# Altium project Delibird.PrjPcb
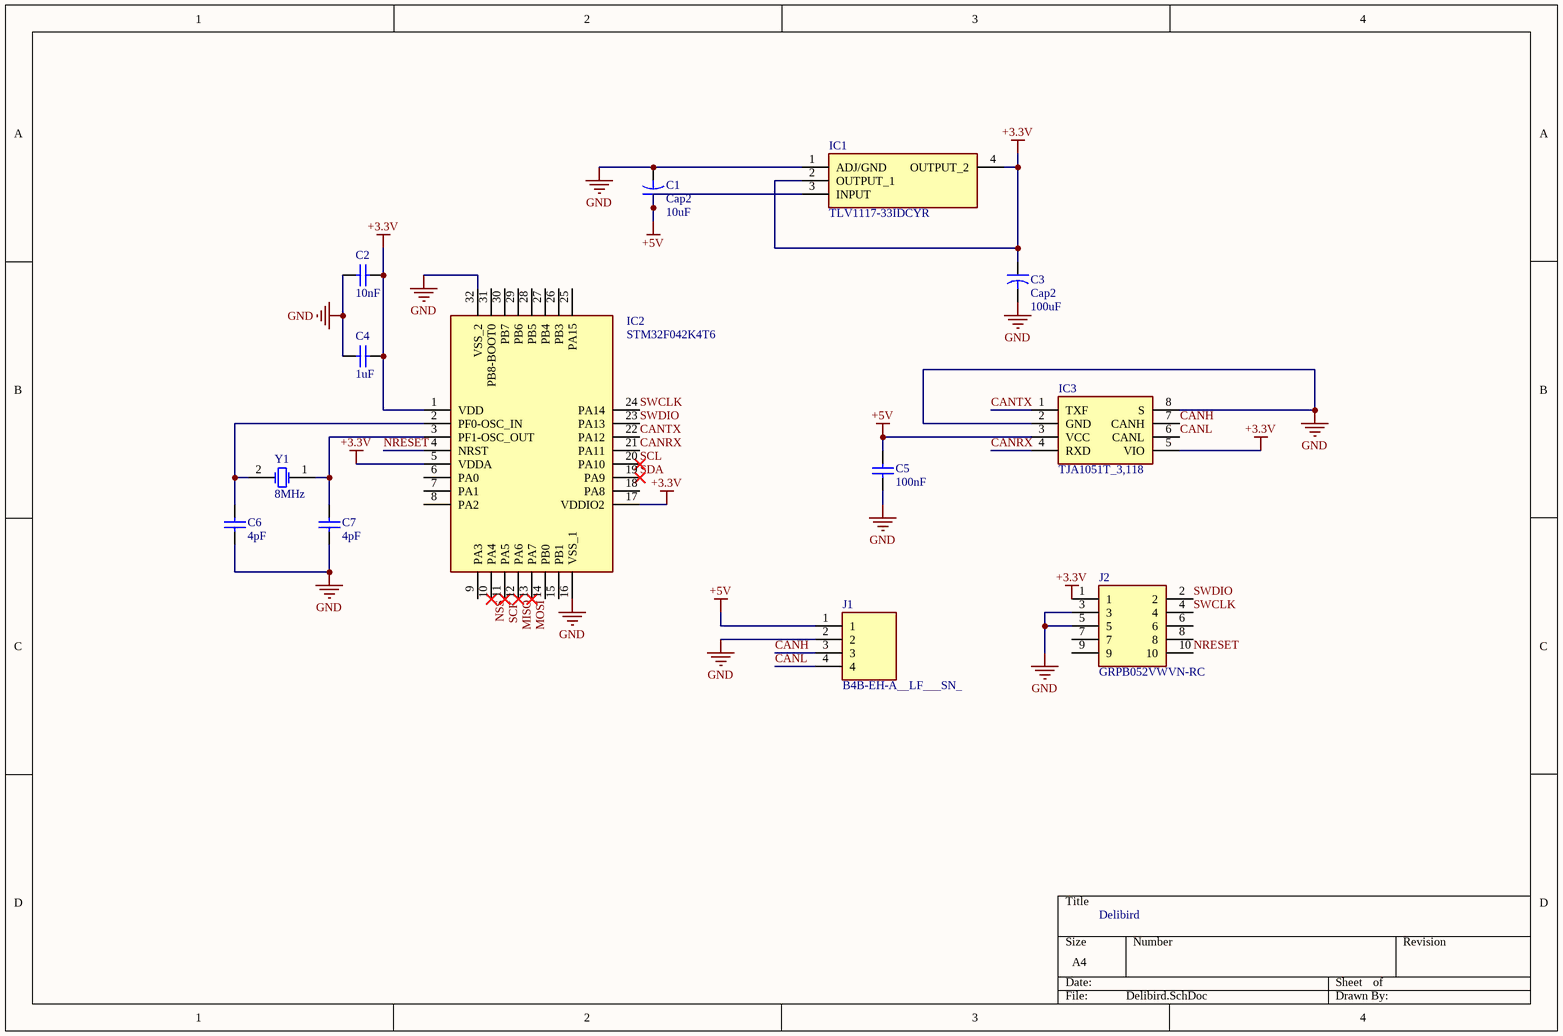
[diagram p0: Delibird.SchDoc]
1 sheet, 13 parts. Net scope: global (net labels, ports and power ports of the same name join across sheets).
Board file: Delibird.PcbDoc

## Sheet Delibird.SchDoc
size A4

### Parts
C1  Cap2  value 10uF  [C0805]
C2  value 10nF  [0805 - Capacitor]  (hidden comment: Capacitor - Nonpolarized)
C3  Cap2  value 100uF  [C0805]
C4  value 1uF  [0805 - Capacitor]  (hidden comment: Capacitor - Nonpolarized)
C5  value 100nF  [0805 - Capacitor]  (hidden comment: Capacitor - Nonpolarized)
C6  value 4pF  [0805 - Capacitor]  (hidden comment: Capacitor - Nonpolarized)
C7  value 4pF  [0805 - Capacitor]  (hidden comment: Capacitor - Nonpolarized)
IC1  TLV1117-33IDCYR  [SOT230P700X180-4N]
IC2  STM32F042K4T6  [QFP80P900X900X160-32N]
IC3  TJA1051T_3,118  [SOIC127P600X175-8N]
J1  B4B-EH-A__LF___SN_  [SHDR4W64P0X250_1X4_1250X380X600P]
J2  GRPB052VWVN-RC  [HDRV10W50P127_2X5_635X340X430P]
Y1  value 8MHz  [CX5032GB08000H0HPQZ1]  (hidden comment: Oscillator)

### Nets
+3.3V: C2.1 C3.1 C4.1 IC1.2(OUTPUT_1) IC1.4(OUTPUT_2) IC2.1(VDD) IC2.5(VDDA) IC2.17(VDDIO2) IC3.5(VIO) J2.1
+5V: C1.1 C5.1 IC1.3(INPUT) IC3.3(VCC) J1.1
GND: C1.2 C2.2 C3.2 C4.2 C5.2 C6.1 C7.1 IC1.1(ADJ/GND) IC2.16(VSS_1) IC2.32(VSS_2) IC3.2(GND) IC3.8(S) J1.2 J2.3 J2.5
CANH: IC3.7(CANH) J1.3
CANL: IC3.6(CANL) J1.4
CANRX: IC2.21(PA11) IC3.4(RXD)
CANTX: IC2.22(PA12) IC3.1(TXF)
MISO: IC2.12(PA6)
MOSI: IC2.13(PA7)
NRESET: IC2.4(NRST) J2.10
NSS: IC2.10(PA4)
SCK: IC2.11(PA5)
SCL: IC2.20(PA10)
SDA: IC2.19(PA9)
SWCLK: IC2.24(PA14) J2.4
SWDIO: IC2.23(PA13) J2.2
NetC6_2: C6.2 IC2.2(PF0-OSC_IN) Y1.2(OSC2)
NetC7_2: C7.2 IC2.3(PF1-OSC_OUT) Y1.1(OSC1)

Not connected (* = marked no-connect by the designer): IC2 6(PA0) 7(PA1) 8(PA2) 9(PA3) 14(PB0) 15(PB1) 18(PA8) 25(PA15) 26(PB3) 27(PB4) 28(PB5) 29(PB6) 30(PB7) 31(PB8-BOOT0); J2 6 7 8 9

### Notes on the sheet
- Delibird

### Library data of the parts
C1 C3 = Cap2: Capacitor; Published: 23-Sep-2002; PackageReference: CAPR5-4X5; Publisher: Altium Limited; PackageDescription: Capacitor; 2 Leads
C2 C4-C7 = Capacitor - Nonpolarized: Nonpolarized Capacitor; Supplier Part Number: *; Supplier: *; Manufacturer: *; Rating: *; Manufacturer Part Number: *
IC1 = TLV1117-33CDCYR: Integrated Circuit; Manufacturer_Name: Texas Instruments; Datasheet Link: http://www.ti.com/lit/gpn/tlv1117; Height: 1.8mm; Manufacturer_Part_Number: TLV1117-33CDCYR; Arrow Part Number: TLV1117-33CDCYR; Arrow Price/Stock: https://www.arrow.com/en/products/tlv1117-33cdcyr/texas-instruments; Mouser Part Number: 595-TLV1117-33CDCYR; Mouser Price/Stock: https://www.mouser.co.uk/ProductDetail/Texas-Instruments/TLV1117-33CDCYR?qs=p6lVfQR1GSoiRKz8KGIbKg%3D%3D
IC2 = STM32F042K4T6: Integrated Circuit; Manufacturer_Name: STMicroelectronics; Datasheet Link: https://www.mouser.com/datasheet/2/389/stm32f042c4-956225.pdf; Height: 1.6mm; Manufacturer_Part_Number: STM32F042K4T6; Arrow Part Number: STM32F042K4T6; Arrow Price/Stock: https://www.arrow.com/en/products/stm32f042k4t6/stmicroelectronics; Mouser Part Number: 511-STM32F042K4T6; Mouser Price/Stock: https://www.mouser.co.uk/ProductDetail/STMicroelectronics/STM32F042K4T6?qs=ClYTdQWm4hDAfZj5dd9NhA%3D%3D
IC3 = TJA1051T_3,118: Integrated Circuit; Manufacturer_Name: NXP; Manufacturer_Part_Number: TJA1051T/3,118; Datasheet Link: http://www.nxp.com/docs/en/data-sheet/TJA1051.pdf; Height: 1.75mm; Arrow Part Number: TJA1051T/3,118; Arrow Price/Stock: https://www.arrow.com/en/products/tja1051t3118/nxp-semiconductors; Mouser Part Number: 771-TJA1051T3118; Mouser Price/Stock: https://www.mouser.co.uk/ProductDetail/NXP-Semiconductors/TJA1051T-3118?qs=O%2F7ihdSJpebv1PFlp05wnQ%3D%3D
J1 = B4B-EH-A__LF___SN_: Connector; Manufacturer_Name: JST (JAPAN SOLDERLESS TERMINALS); Manufacturer_Part_Number: B4B-EH-A (LF) (SN); Datasheet Link: http://www.jst-mfg.com/product/pdf/eng/eEH.pdf; Height: 6mm; Arrow Part Number: B4B-EH-A (LF) (SN)
J2 = GRPB052VWVN-RC: Connector; Manufacturer_Name: Sullins; Datasheet Link: https://media.digikey.com/pdf/Data%20Sheets/Sullins%20PDFs/GRPB_%20_2VWVN-RC%2010954-C.pdf; Height: 4.3mm; Manufacturer_Part_Number: GRPB052VWVN-RC; Arrow Part Number: GRPB052VWVN-RC
Y1 = Oscillator: Crystal Oscillator; Manufacturer Part Number: *; Manufacturer: CX5032GB08000H0HPQZ1; Supplier Part Number: *; Supplier: *; Rating: *